# Altium schematic sheet deepshark_servo.SchDoc
size A4
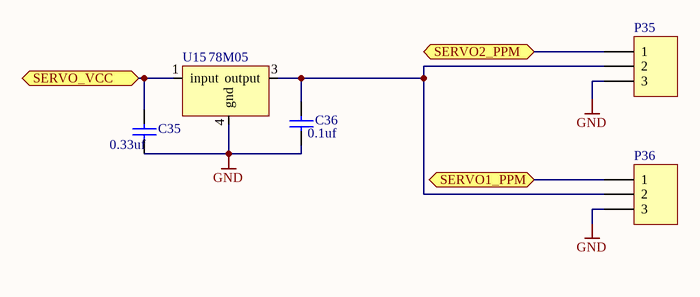
[diagram p0: deepshark_servo.SchDoc]

## Parts
C35  value 0.33uf  [C1206]  (hidden comment: Cap Semi)
C36  value 0.1uf  [6-0805_M]  (hidden comment: Cap Semi)
P35  Header 3  [HDR1X3]  (value not drawn)
P36  Header 3  [HDR1X3]  (value not drawn)
U15  78M05  [TO-252AA]

## Ports
SERVO1_PPM, SERVO2_PPM, SERVO_VCC

## Nets
GND: C35.1 C36.1 P35.3 P36.3 U15.4(gnd)
SERVO1_PPM: P36.1 ; port SERVO1_PPM
SERVO2_PPM: P35.1 ; port SERVO2_PPM
SERVO_VCC: C35.2 U15.1(input) ; port SERVO_VCC
NetC36_2: C36.2 P35.2 P36.2 U15.3(output)

## Library data of the parts
C35 C36 = Cap Semi: Capacitor (Semiconductor SIM Model); Published: 8-Jun-2000; LatestRevisionDate: 29-May-2009; LatestRevisionNote: IPC-7351 Footprint Added.; PackageReference: C1206; Publisher: Altium Limited; PackageDescription: Chip Capacitor
P35 P36 = Header 3: Header, 3-Pin; LatestRevisionDate: 17-Jul-2002; LatestRevisionNote: Re-released for DXP Platform.; Publisher: Altium Limited